# EAGLE design pcb (EAGLE 9.6.2)
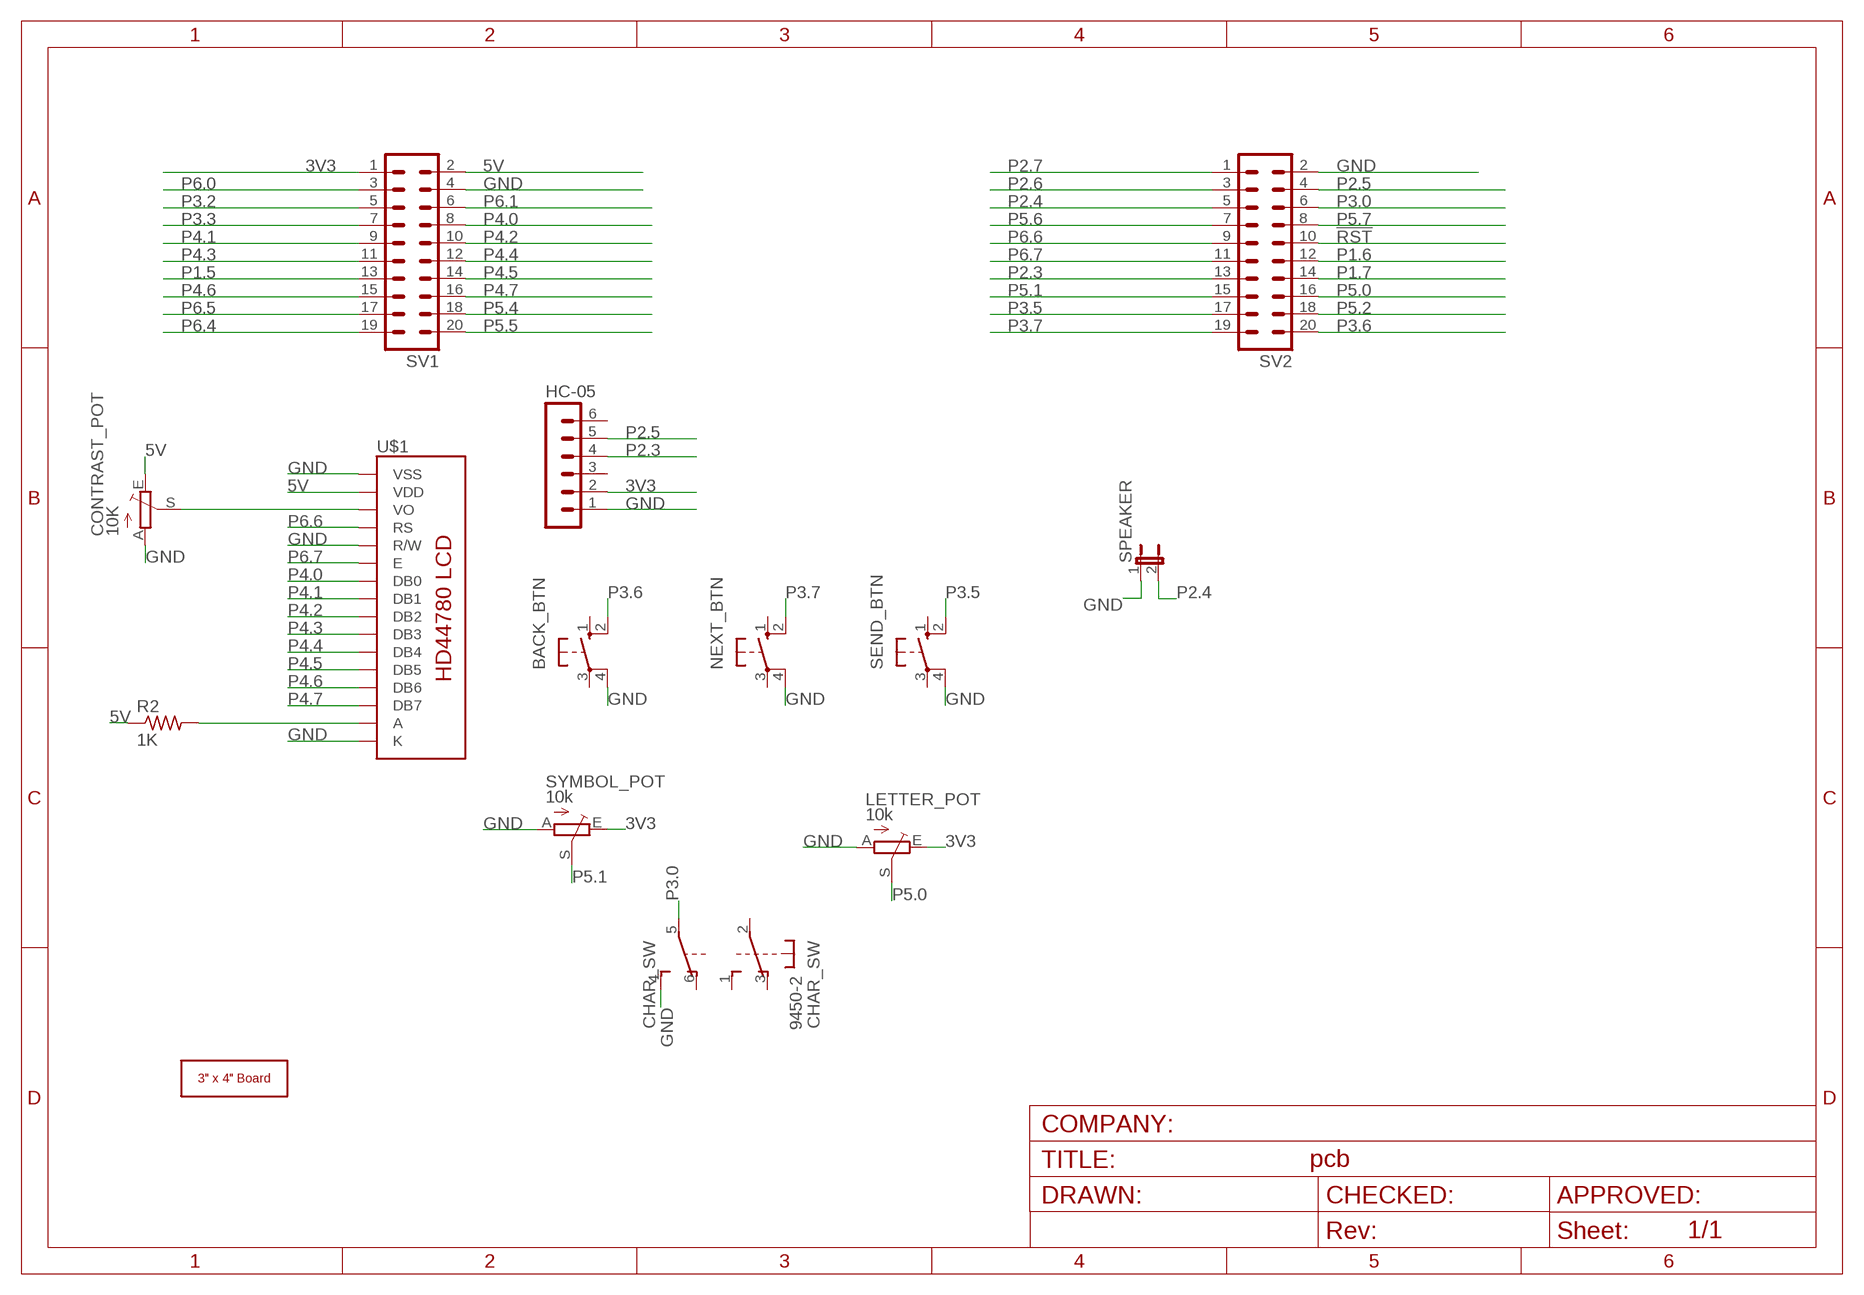
[diagram p0: schematic, sheet 1]

## Parts
BACK_BTN  10-XX  [B3F-10XX]
CHAR_SW  9450-2  [9450-2]
CONTRAST_POT  10K  TRIM_EU-B25V  [B25V]
HC-05  MA06-1  [MA06-1]
LETTER_POT  10k  TRIM_EU-B25V  [B25V]
NEXT_BTN  10-XX  [B3F-10XX]
R2  1K  R-US_0204/7  [0204/7]
SEND_BTN  10-XX  [B3F-10XX]
SPEAKER  JP1E  [JP1]
SV1  MA10-2  [MA10-2]
SV2  MA10-2  [MA10-2]
SYMBOL_POT  10k  TRIM_EU-B25V  [B25V]
U$1  LCD-HD447804-HOLES16X2-4-HOLES  [LCD-16X2-4HOLES]
U$3  3X4_BOARD  [3X4_BOARD_V1]

## Nets
3V3: HC-05.2 LETTER_POT.E SV1.1 SYMBOL_POT.E
5V: CONTRAST_POT.E R2.1 SV1.2 U$1.2(VDD)
!RST: SV2.10
GND: BACK_BTN.4(P1) CHAR_SW.4(2:S) CONTRAST_POT.A HC-05.1 LETTER_POT.A NEXT_BTN.4(P1) SEND_BTN.4(P1) SPEAKER.1 SV1.4 SV2.2 SYMBOL_POT.A U$1.1(VSS) U$1.5(R/W) U$1.16(K)
N$2: CONTRAST_POT.S U$1.3(VO)
N$15: R2.2 U$1.15(A)
P1.5: SV1.13
P1.6: SV2.12
P1.7: SV2.14
P2.3: HC-05.4 SV2.13
P2.4: SPEAKER.2 SV2.5
P2.5: HC-05.5 SV2.4
P2.6: SV2.3
P2.7: SV2.1
P3.0: CHAR_SW.5(2:P) SV2.6
P3.2: SV1.5
P3.3: SV1.7
P3.5: SEND_BTN.2(S1) SV2.17
P3.6: BACK_BTN.2(S1) SV2.20
P3.7: NEXT_BTN.2(S1) SV2.19
P4.0: SV1.8 U$1.7(DB0)
P4.1: SV1.9 U$1.8(DB1)
P4.2: SV1.10 U$1.9(DB2)
P4.3: SV1.11 U$1.10(DB3)
P4.4: SV1.12 U$1.11(DB4)
P4.5: SV1.14 U$1.12(DB5)
P4.6: SV1.15 U$1.13(DB6)
P4.7: SV1.16 U$1.14(DB7)
P5.0: LETTER_POT.S SV2.16
P5.1: SV2.15 SYMBOL_POT.S
P5.2: SV2.18
P5.4: SV1.18
P5.5: SV1.20
P5.6: SV2.7
P5.7: SV2.8
P6.0: SV1.3
P6.1: SV1.6
P6.4: SV1.19
P6.5: SV1.17
P6.6: SV2.9 U$1.4(RS)
P6.7: SV2.11 U$1.6(E)
Unconnected: BACK_BTN.1(S) BACK_BTN.3(P) CHAR_SW.1(1:S) CHAR_SW.2(1:P) CHAR_SW.3(1:O) CHAR_SW.6(2:O) HC-05.3 HC-05.6 NEXT_BTN.1(S) NEXT_BTN.3(P) SEND_BTN.1(S) SEND_BTN.3(P)

## Library data of the parts
BACK_BTN NEXT_BTN SEND_BTN = switch-omron-voltera:10-XX: OMRON SWITCH; MPN: B3F-1000; OC_FARNELL: 176432; OC_NEWARK: 36M3542
CHAR_SW = switch-misc-voltera:9450-2: MARQUARDT SWITCH
CONTRAST_POT LETTER_POT SYMBOL_POT = pot-voltera:TRIM_EU-: POTENTIOMETER
HC-05 = con-lstb-voltera:MA06-1: PIN HEADER; OC_FARNELL: unknown; OC_NEWARK: unknown
R2 = rcl-voltera:R-US_: RESISTOR, American symbol; SPICEPREFIX: R
SPEAKER = jumper-voltera:JP1E: JUMPER
SV1 SV2 = con-lstb-voltera:MA10-2: PIN HEADER; OC_FARNELL: unknown; OC_NEWARK: unknown
U$1 = HD44780LCD:LCD-HD44780
U$3 = voltera_community_lib:3X4_BOARD

## Net classes
0 default: width 0.254 mm, drill 0.7 mm
2 Power: width 0.203 mm, drill 0.305 mm, clearance 0.152 mm to class 0, clearance 0.152 mm to class 1, clearance 0.152 mm

## Board
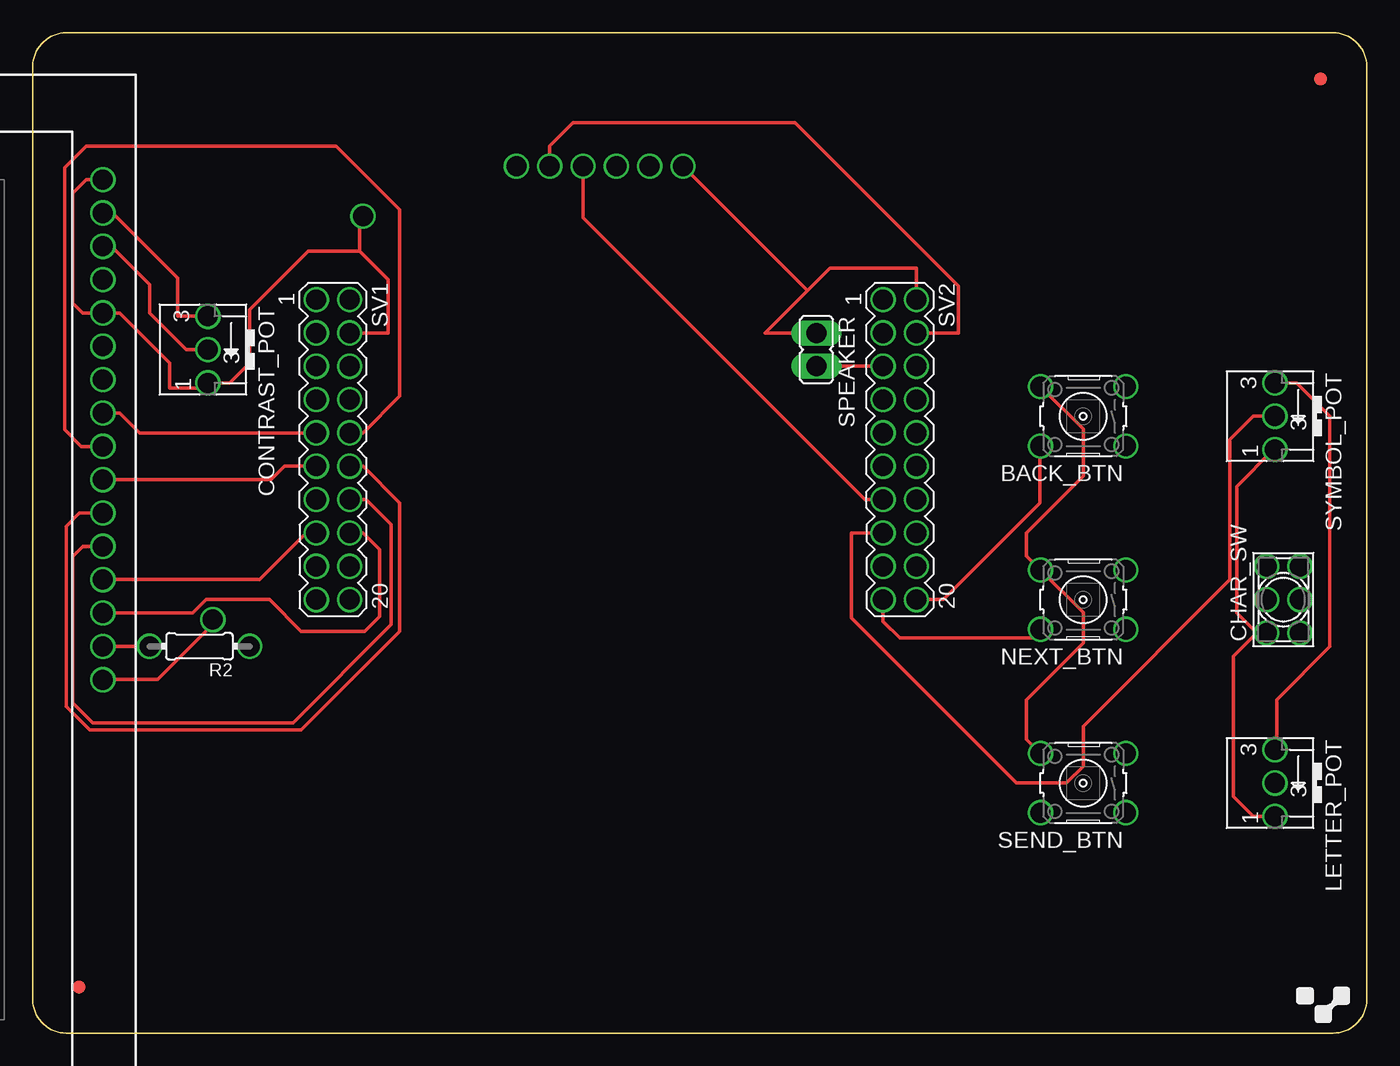
[diagram p1: board, top side]
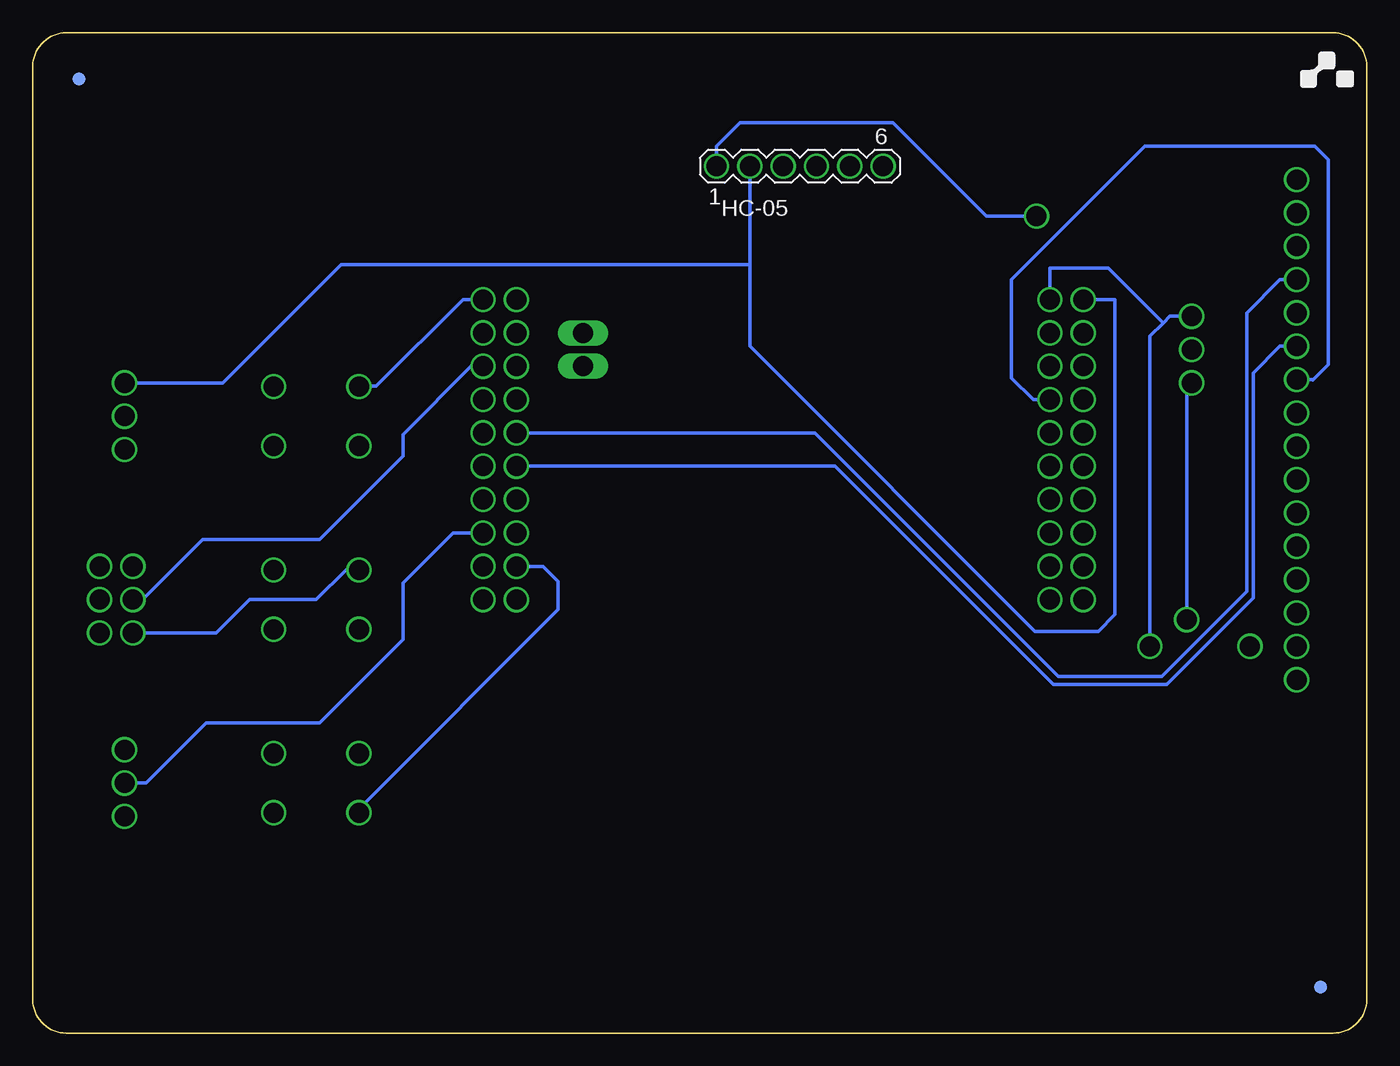
[diagram p2: board, bottom side, seen from below]

Size 101.6 x 76.2 mm. Coordinates in mm from the lower left corner, seen from the top.
Copper layers (1*16): Top 0.035mm / dielectric 1.5mm / Bottom 0.035mm
Design rules "voltera-dru": minimum track width 10mil, minimum drill 0.4mm, track to track 10mil, track to pad 10mil, pad to pad 0.6mm, via to via 0.6mm, smd to smd 0mil, copper to edge 0mil, drill to drill 0.8mm, minimum pad ring 0.2mm, minimum via ring 0.2mm, stop-mask expansion 4mil, vias tented up to drill 0mil, thermal gap 10mil

### Footprints (pad centres in the part's own frame; a part is rotated, then mirrored left to right if it is on the bottom)
B3F-10XX = drill 1.524 pad 1.778: 1 -3.251,2.261; 2 3.251,2.261; 3 -3.251,-2.261; 4 3.251,-2.261
9450-2 = drill 1.524 pad 1.778: 1 -2.54,-1.27; 2 0,-1.27; 3 2.54,-1.27; 4 -2.54,1.27; 5 0,1.27; 6 2.54,1.27
B25V = drill 1.524 pad 1.778: A 2.54,0.635; E -2.54,0.635; S 0,0.635
MA06-1 = drill 1.524 pad 1.778: 1 -6.35,0; 2 -3.81,0; 3 -1.27,0; 4 1.27,0; 5 3.81,0; 6 6.35,0
0204/7 = drill 1.524 pad 1.778: 1 -3.81,0; 2 3.81,0
JP1 = drill 1.524 pad 1.778 long: 1 0,-1.27; 2 0,1.27
MA10-2 = drill 1.524 pad 1.778: 1 -11.43,-1.27; 2 -11.43,1.27; 3 -8.89,-1.27; 4 -8.89,1.27; 5 -6.35,-1.27; 6 -6.35,1.27; 7 -3.81,-1.27; 8 -3.81,1.27; 9 -1.27,-1.27; 10 -1.27,1.27; 11 1.27,-1.27; 12 1.27,1.27; 13 3.81,-1.27; 14 3.81,1.27; 15 6.35,-1.27; 16 6.35,1.27; 17 8.89,-1.27; 18 8.89,1.27; 19 11.43,-1.27; 20 11.43,1.27
LCD-16X2-4HOLES = drill 1.524 pad 1.778: 1 -32,15.5; 2 -29.46,15.5; 3 -26.92,15.5; 4 -24.38,15.5; 5 -21.84,15.5; 6 -19.3,15.5; 7 -16.76,15.5; 8 -14.22,15.5; 9 -11.68,15.5; 10 -9.14,15.5; 11 -6.6,15.5; 12 -4.06,15.5; 13 -1.52,15.5; 14 1.02,15.5; 15 3.56,15.5; 16 6.1,15.5
3X4_BOARD_V1 = smd 1 x 1: P$1 98.1,72.7; P$3 3.5,3.5 | smd 1 x 1 bottom: P$4 3.5,3.5; P$5 98.1,72.7

### Placement (x,y rotation side)
BACK_BTN  80.01,46.99 180 top
CHAR_SW  95.25,33.02 90 top
CONTRAST_POT  12.7,52.07 270 top
HC-05  43.18,66.04 0 bottom
LETTER_POT  93.98,19.05 270 top
NEXT_BTN  80.01,33.02 180 top
R2  12.7,29.46 180 top
SEND_BTN  80.01,19.05 180 top
SPEAKER  59.69,52.07 180 top
SV1  22.86,44.45 270 top
SV2  66.04,44.45 270 top
SYMBOL_POT  93.98,46.99 270 top
U$1  -10.16,33.02 270 top
U$3  0,0 0 top

### Tracks (layer width: path | path; a pad name or v marks a point on that pad's centre or on a via)
3V3
  Top 0.254: SYMBOL_POT.E 96.27,49.53 98.81,46.99 98.81,29.46 94.74,25.4 94.74,21.59 LETTER_POT.E
  Bottom 0.254: SV1.1 19.18,55.88 19.18,31.88 20.45,30.61 25.27,30.61 46.99,52.32 46.99,58.55 | HC-05.2 46.99,58.55 | SYMBOL_POT.E 87.12,49.53 78.1,58.55 46.99,58.55
5V
  Top 0.254: U$1.2 6.1,62.48 11.05,57.53 11.05,54.61 CONTRAST_POT.E
  Bottom 0.254: R2.1 16.51,53.09 15.49,54.1 | 15.49,54.1 14.99,54.61 CONTRAST_POT.E | SV1.2 24.13,58.29 19.69,58.29 15.49,54.1
GND  (via drill 1.52)
  Top 0.254: v13.72,31.5 13.72,31.12 9.52,26.92 U$1.16 | SV1.4 27.05,53.34 27.05,57.4 24.89,59.56 | 24.89,59.56 20.96,59.56 16.51,55.12 16.51,51.05 14.99,49.53 CONTRAST_POT.A 12.95,49.15 10.42,49.15 10.42,51.05 6.61,54.86 U$1.5 3.81,54.86 3.05,55.63 3.05,64 4.07,65.02 U$1.1 | 93.22,30.48 91.69,32 91.69,41.66 94.49,44.45 SYMBOL_POT.A | LETTER_POT.A 92.96,16.51 91.44,18.03 91.44,28.7 93.22,30.48 | 93.22,30.48 CHAR_SW.4 | SEND_BTN.4 75.69,22.38 75.69,25.4 80.01,29.72 80.01,32.03 NEXT_BTN.4 75.69,36.35 75.69,38.1 80.01,42.42 80.01,46 BACK_BTN.4 | SV2.2 67.31,58.29 60.71,58.29 58.99,56.58 | 58.99,56.58 55.75,53.34 SPEAKER.1 | 58.99,56.58 HC-05.1 | 24.89,59.56 24.89,61.98 v25.15,62.23
  Bottom 0.254: v13.72,31.5 13.72,49.28 13.46,49.53 CONTRAST_POT.A | SV2.2 68.83,55.88 75.44,49.28 76.78,49.28 BACK_BTN.4 | CHAR_SW.4 87.63,30.48 85.09,33.02 80.01,33.02 77.75,35.28 NEXT_BTN.4 | v25.15,62.23 28.96,62.23 36.07,69.34 47.75,69.34 49.53,67.56 HC-05.1
N$2
  Top 0.254: CONTRAST_POT.S 11.68,52.07 8.89,54.86 8.89,57.03 5.98,59.94 U$1.3
N$15
  Top 0.254: R2.2 U$1.15
P2.3
  Top 0.254: SV2.13 63.37,40.64 41.91,62.1 HC-05.4
P2.4
  Top 0.254: SPEAKER.2 SV2.5
P2.5
  Top 0.254: SV2.4 70.48,53.34 70.48,56.9 58.04,69.34 41.15,69.34 39.37,67.56 HC-05.5
P3.0
  Bottom 0.254: SV2.6 68.2,50.8 73.41,45.59 73.41,43.94 79.76,37.59 88.65,37.59 93.22,33.02 CHAR_SW.5
P3.5
  Bottom 0.254: SV2.17 62.74,35.56 61.6,34.42 61.6,32.26 76.38,17.48 76.38,17.17 SEND_BTN.2
P3.6
  Top 0.254: SV2.20 69.34,33.02 76.71,40.39 76.71,44.78 76.76,44.83 BACK_BTN.2
P3.7
  Top 0.254: SV2.19 64.77,31.37 66.04,30.1 76.1,30.1 NEXT_BTN.2
P4.0
  Bottom 0.254: SV1.8 25.4,48.26 27.05,49.91 27.05,57.4 16.89,67.56 3.94,67.56 2.92,66.55 2.92,50.93 4.1,49.75 4.13,49.78 U$1.7
P4.1
  Top 0.254: SV1.9 8.13,45.72 6.61,47.24 U$1.8
P4.2
  Top 0.254: U$1.9 3.68,44.7 2.41,45.97 2.41,65.91 4.06,67.56 23.11,67.56 27.94,62.74 27.94,48.51 25.15,45.72 SV1.10
P4.3
  Top 0.254: SV1.11 19.18,43.18 18.16,42.16 U$1.10
P4.4
  Top 0.254: U$1.11 3.55,39.62 2.54,38.61 2.54,24.89 4.32,23.11 20.45,23.11 27.94,30.61 27.94,40.39 25.15,43.18 SV1.12
P4.5
  Top 0.254: U$1.12 3.81,37.08 3.05,36.32 3.05,25.15 4.57,23.62 19.81,23.62 27.3,31.12 27.3,38.73 25.4,40.64 SV1.14
P4.6
  Top 0.254: SV1.15 20.83,38.1 17.27,34.54 6.86,34.54 6.85,34.54 U$1.13
P4.7
  Top 0.254: SV1.16 25.15,38.1 26.42,36.83 26.42,31.75 25.27,30.61 20.45,30.61 18.03,33.02 13.21,33.02 12.19,32 5.59,32 5.46,31.88 U$1.14
P5.0
  Bottom 0.254: SV2.16 69.6,38.1 73.41,34.29 73.41,29.97 79.76,23.62 88.39,23.62 92.96,19.05 LETTER_POT.S
P5.1
  Top 0.254: SV2.15 62.36,38.1 62.36,31.62 74.93,19.05 78.74,19.05 80.01,20.32 80.01,23.37 91.19,34.54 91.19,45.21 92.96,46.99 SYMBOL_POT.S
P6.6
  Bottom 0.254: SV2.9 42.04,45.72 23.5,27.18 15.62,27.18 9.14,33.66 9.14,54.87 6.61,57.4 U$1.4
P6.7
  Bottom 0.254: SV2.11 40.51,43.18 23.88,26.54 15.24,26.54 8.64,33.15 8.64,50.29 6.61,52.32 U$1.6